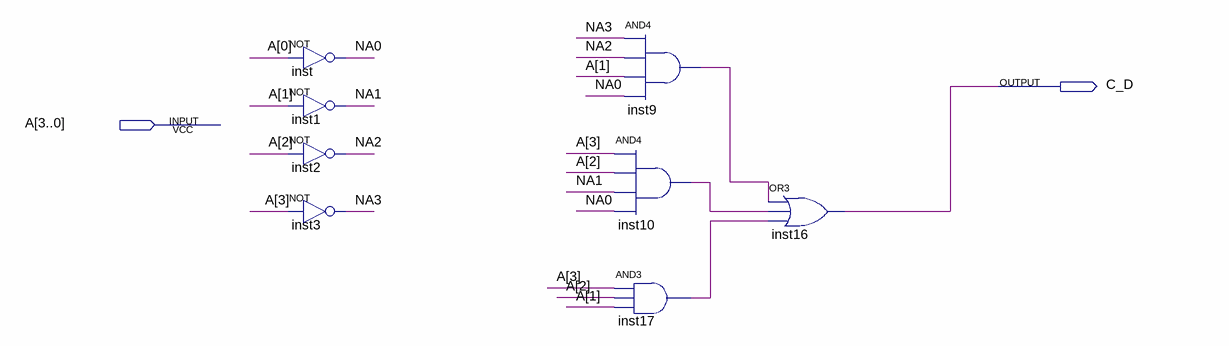
[diagram p0: schematic sheet]
// Quartus schematic Diplay_C.bdf as structural Verilog: 8 symbols, 2 pins
module Diplay_C (
  input  [3:0] A,
  output C_D
);

  wire inst9_out, inst10_out, inst17_out, NA0, NA1, NA2, NA3;

  not inst (NA0, A[0]);
  not inst1 (NA1, A[1]);
  not inst2 (NA2, A[2]);
  not inst3 (NA3, A[3]);
  and inst9 (inst9_out, NA3, NA2, A[1], NA0);
  and inst10 (inst10_out, A[3], A[2], NA1, NA0);
  and inst17 (inst17_out, A[3], A[2], A[1]);
  or inst16 (C_D, inst9_out, inst10_out, inst17_out);
endmodule
